# EAGLE design fdcanusb (EAGLE 9.6.0)
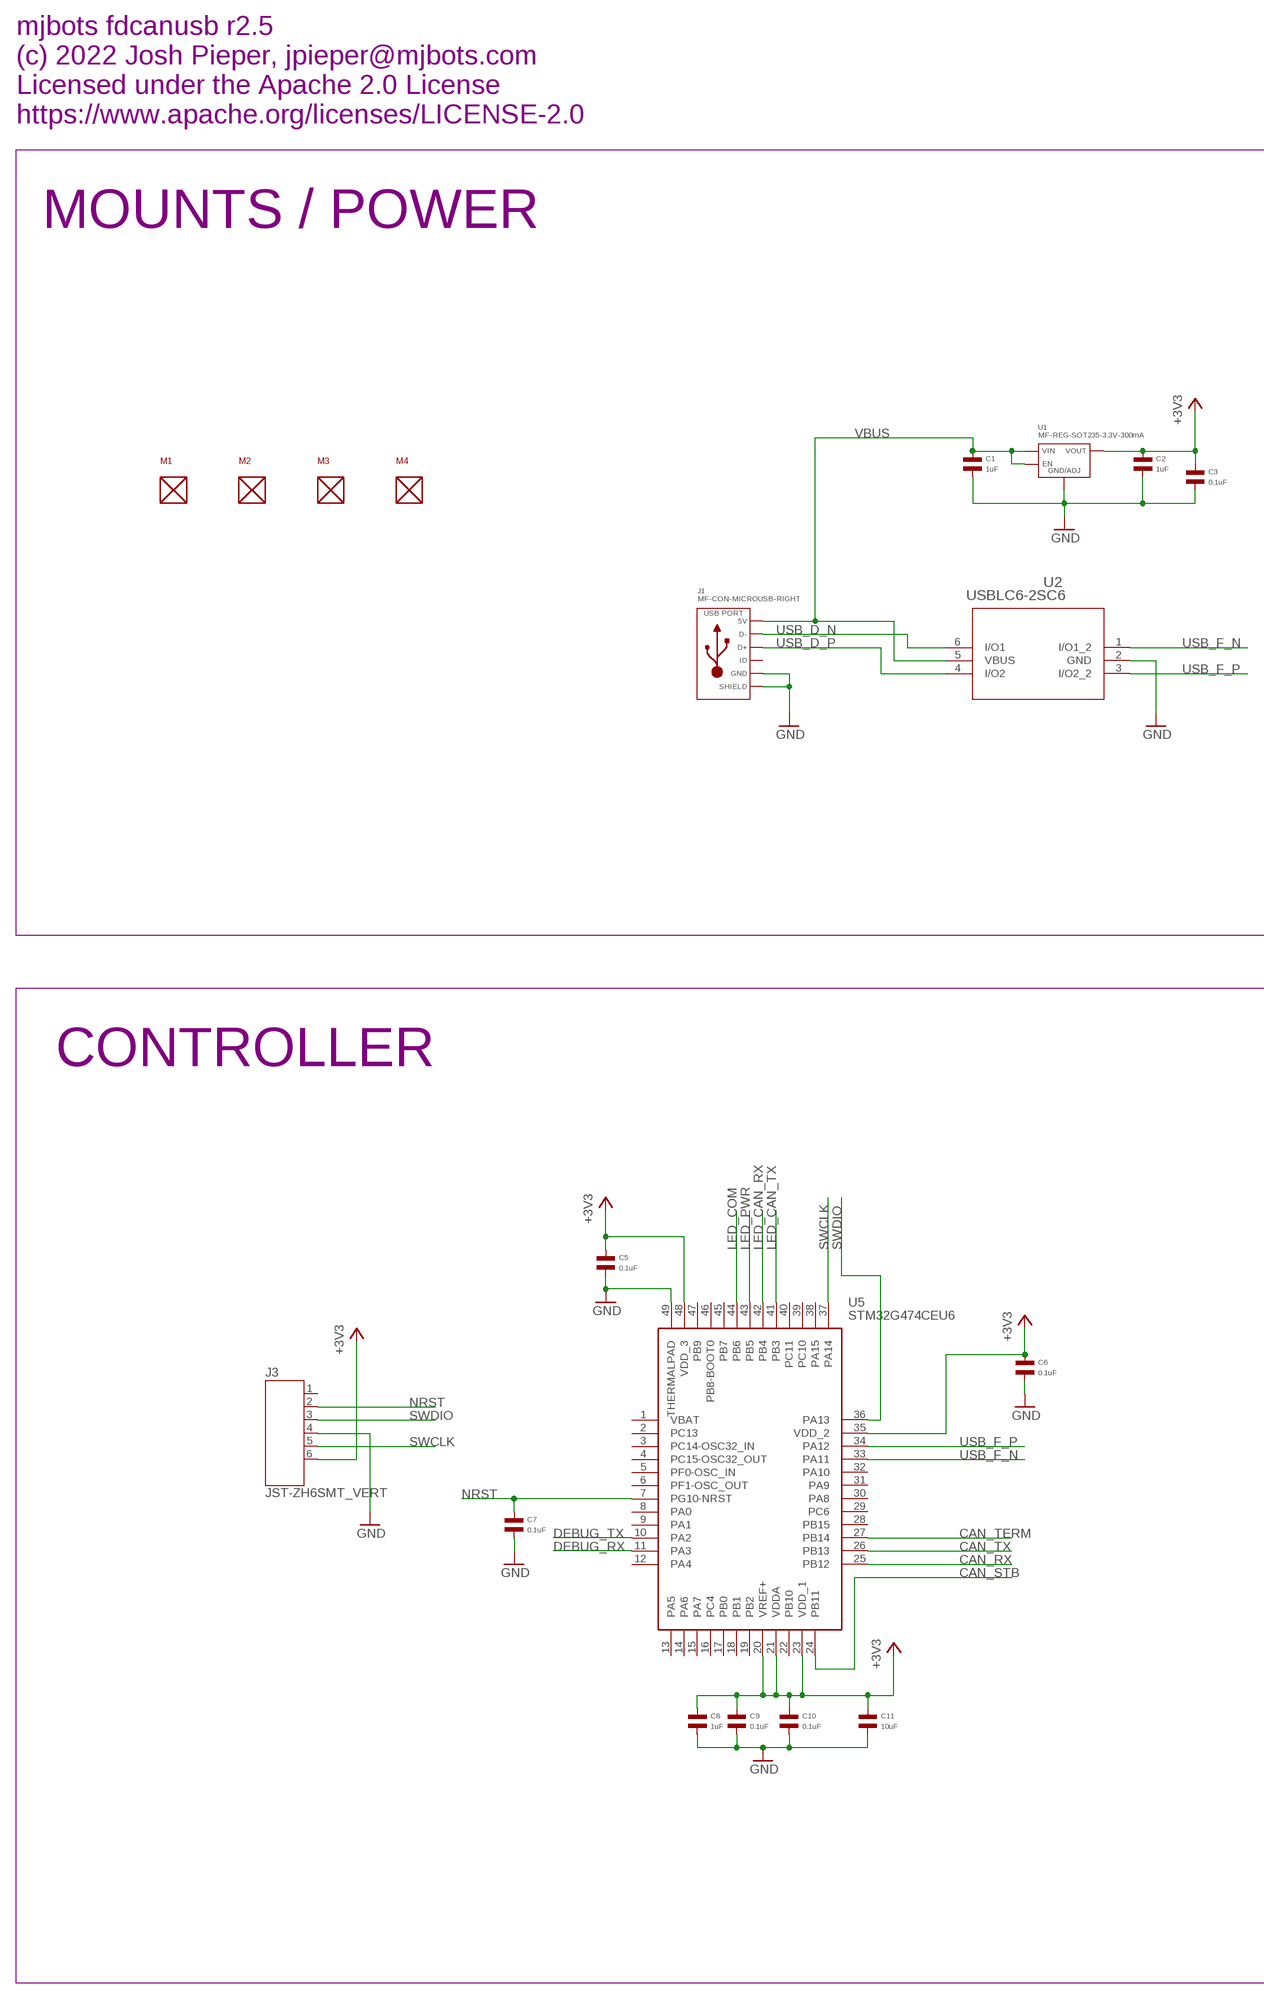
[diagram p0: schematic, sheet 1, part 1 of 2]
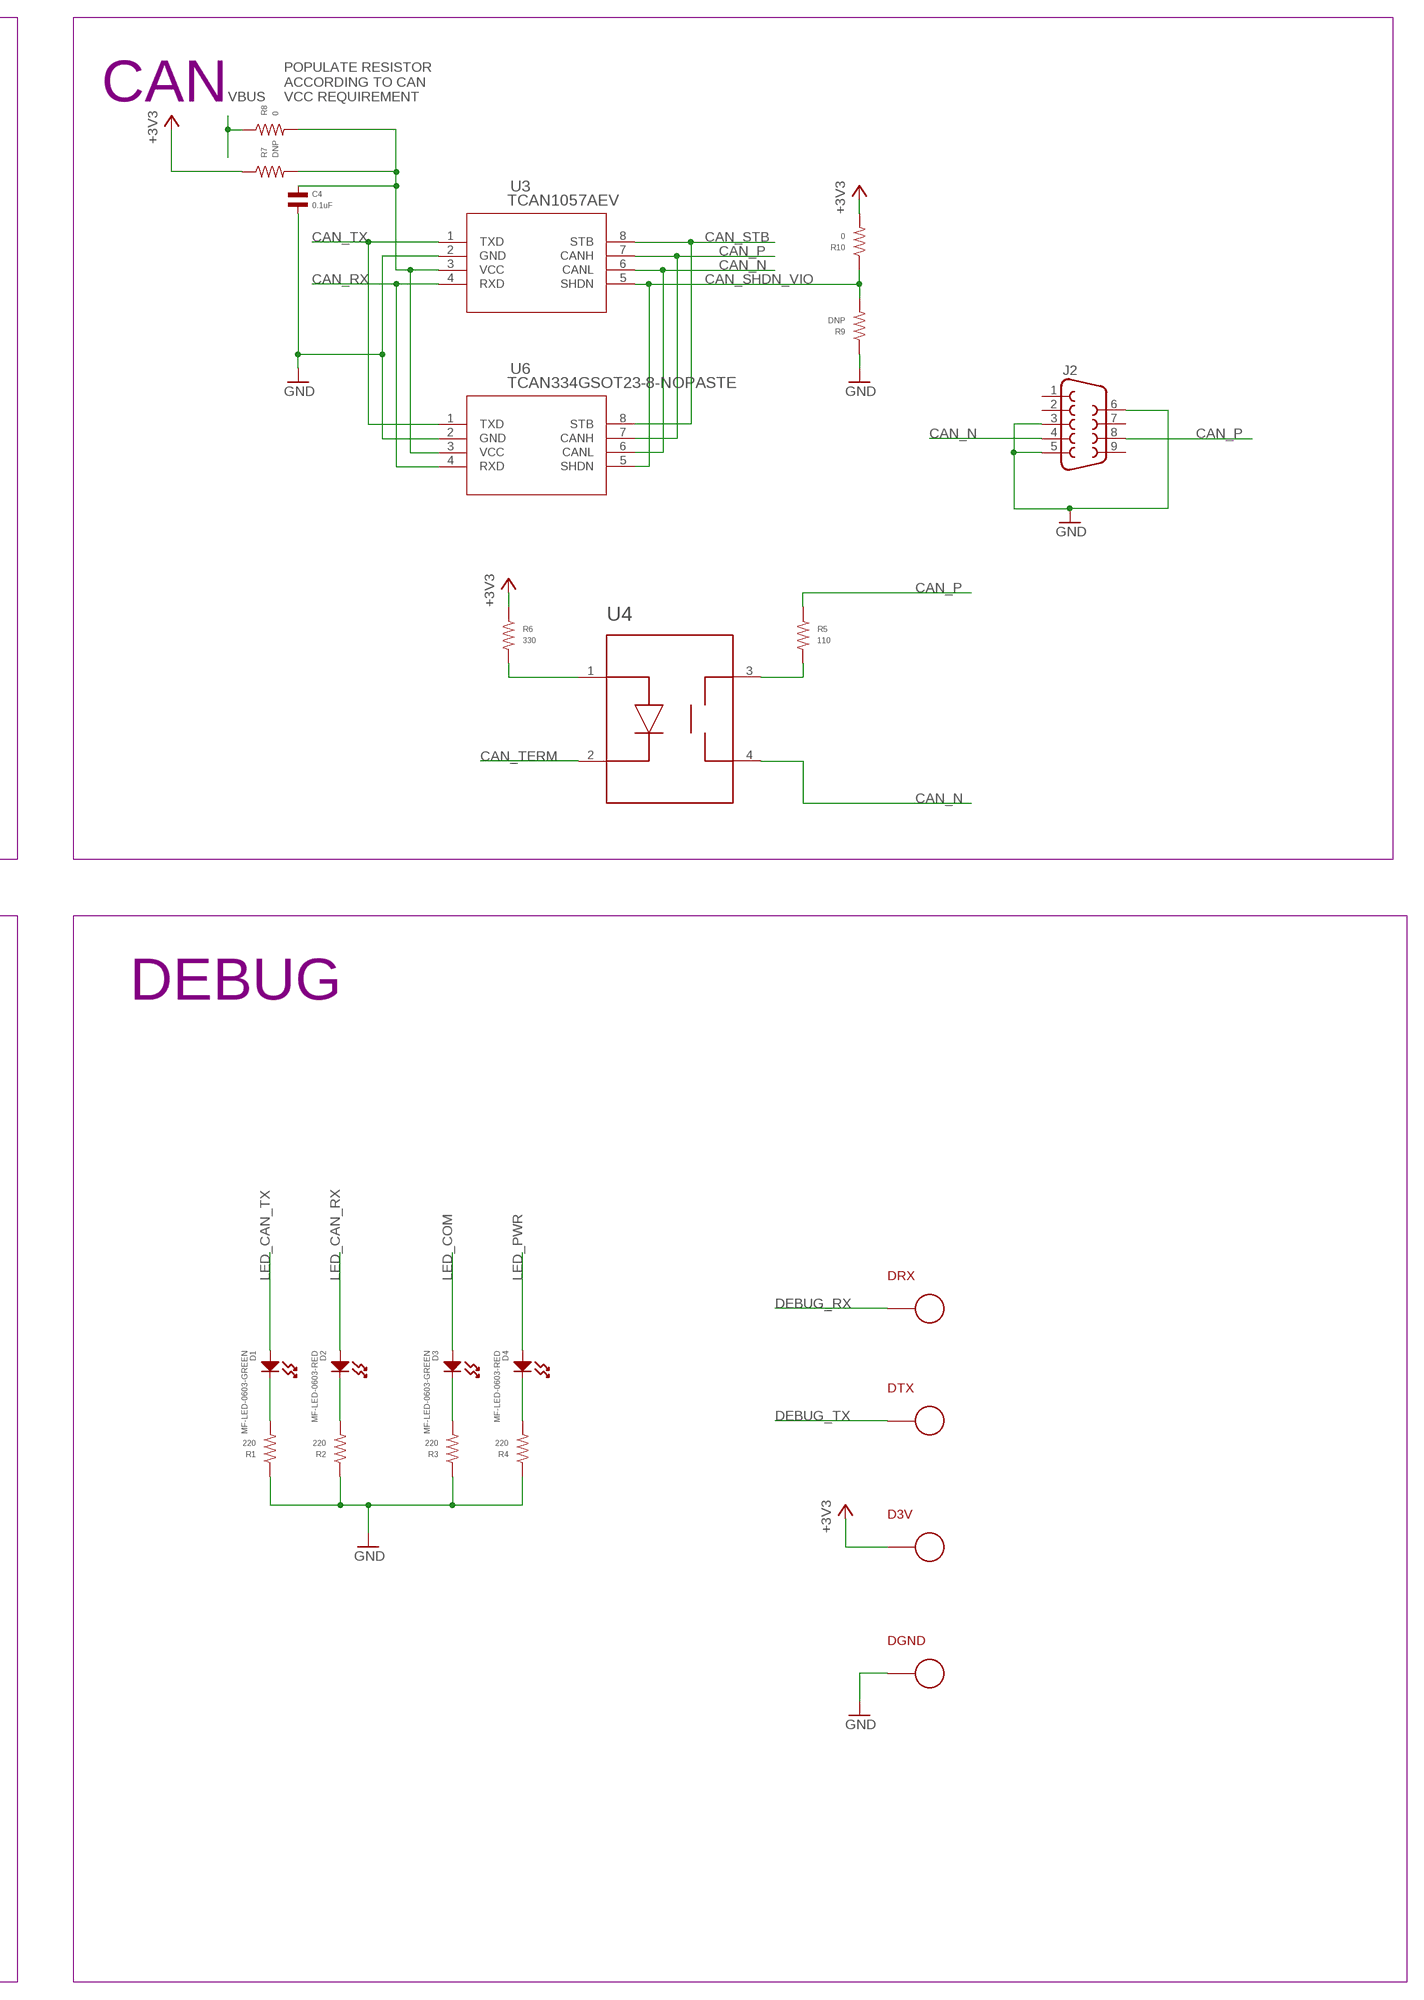
[diagram p1: schematic, sheet 1, part 2 of 2]

## Parts
C1  1uF  CAPACITOR_NP_0603  [C0603]
C2  1uF  CAPACITOR_NP_0603  [C0603]
C3  0.1uF  CAPACITOR_NP_0603  [C0603]
C4  0.1uF  CAPACITOR_NP_0603  [C0603]
C5  0.1uF  CAPACITOR_NP_0603  [C0603]
C6  0.1uF  CAPACITOR_NP_0603  [C0603]
C7  0.1uF  CAPACITOR_NP_0603  [C0603]
C8  1uF  CAPACITOR_NP_0603  [C0603]
C9  0.1uF  CAPACITOR_NP_0603  [C0603]
C10  0.1uF  CAPACITOR_NP_0603  [C0603]
C11  10uF  CAPACITOR_NP_1206  [C1206]
D1  MF-LED-0603-GREEN  LED_SINGLE-0603-GREEN  [LED0603]
D2  MF-LED-0603-RED  LED_SINGLE-0603-RED  [LED0603]
D3  MF-LED-0603-GREEN  LED_SINGLE-0603-GREEN  [LED0603]
D3V  PAD24AWG_PAD  [24AWG_PAD]
D4  MF-LED-0603-RED  LED_SINGLE-0603-RED  [LED0603]
DGND  PAD24AWG_PAD  [24AWG_PAD]
DRX  PAD24AWG_PAD  [24AWG_PAD]
DTX  PAD24AWG_PAD  [24AWG_PAD]
J1  MF-CON-MICROUSB-RIGHT  USB_MICRO_RIGHT  [MICROUSB-RIGHT]
J2  F09  [DB09_PLATED]
J3  JST-ZH6SMT_VERT  [JST_B6B-ZR-SM4-TF(LF)(SN)]
M1  MOUNT  [M2.5MOUNT]
M2  MOUNT  [M2.5MOUNT]
M3  MOUNT  [M2.5MOUNT]
M4  MOUNT  [M2.5MOUNT]
R1  220  RESISTOR_0603  [R0603]
R2  220  RESISTOR_0603  [R0603]
R3  220  RESISTOR_0603  [R0603]
R4  220  RESISTOR_0603  [R0603]
R5  110  RESISTOR_0603  [R0603]
R6  330  RESISTOR_0603  [R0603]
R7  DNP  RESISTOR_0603  [R0603]
R8  0  RESISTOR_0603  [R0603]
R9  DNP  RESISTOR_0603  [R0603]
R10  0  RESISTOR_0603  [R0603]
U1  MF-REG-SOT235-3.3V-300mA  TLV70233PDBVR  [SOT-23-5]
U2  USBLC6-2SC6  [SOT23-6L]
U3  TCAN1057AEV  TCAN334G  [SOIC8]
U4  TLP3317  [TLP3317]
U5  STM32G474CEU6  [QFN50P700X700X60-49N]
U6  TCAN334GSOT23-8-NOPASTE  [SOT23-8-NOPASTE]

## Nets
+3V3: C2.P$1 C3.P$1 C5.P$1 C6.P$1 C8.P$1 C9.P$1 C10.P$1 C11.P$1 D3V.P$1 J3.6 R6.P$1 R7.P$1 R10.P$2 U1.P$5(VOUT) U5.20(VREF+) U5.21(VDDA) U5.23(VDD_1) U5.35(VDD_2) U5.48(VDD_3)
CAN_N [can]: J2.4 U3.6(CANL) U4.4(SW2) U6.6(CANL)
CAN_P [can]: J2.8 R5.P$1 U3.7(CANH) U6.7(CANH)
CAN_RX: U3.4(RXD) U5.25(PB12) U6.4(RXD)
CAN_SHDN_VIO: R9.P$2 R10.P$1 U3.5(SHDN) U6.5(SHDN)
CAN_STB: U3.8(STB) U5.24(PB11) U6.8(STB)
CAN_TERM: U4.2(CATHODE) U5.27(PB14)
CAN_TX: U3.1(TXD) U5.26(PB13) U6.1(TXD)
DEBUG_RX: DRX.P$1 U5.11(PA3)
DEBUG_TX: DTX.P$1 U5.10(PA2)
GND: C1.P$2 C2.P$2 C3.P$2 C4.P$2 C5.P$2 C6.P$2 C7.P$2 C8.P$2 C9.P$2 C10.P$2 C11.P$2 DGND.P$1 J1.5(GND) J1.S1(SLD) J1.S2(SLD) J1.S3(SLD) J1.S4(SLD) J1.S5(SLD) J1.S6(SLD) J2.3 J2.5 J2.6 J3.4 R1.P$1 R2.P$1 R3.P$1 R4.P$1 R9.P$1 U1.P$2(GND/ADJ) U2.2(GND) U3.2(GND) U5.49(THERMALPAD) U6.2(GND)
LED_CAN_RX: D2.ANODE U5.42(PB4)
LED_CAN_TX: D1.ANODE U5.41(PB3)
LED_COM: D3.ANODE U5.44(PB6)
LED_PWR: D4.ANODE U5.43(PB5)
N$1: C4.P$1 R7.P$2 R8.P$2 U3.3(VCC) U6.3(VCC)
N$3: D1.CATHODE R1.P$2
N$4: D2.CATHODE R2.P$2
N$5: D3.CATHODE R3.P$2
N$6: D4.CATHODE R4.P$2
N$7: R5.P$2 U4.3(SW1)
N$8: R6.P$2 U4.1(ANODE)
NRST: C7.P$1 J3.2 U5.7(PG10-NRST)
SWCLK: J3.5 U5.37(PA14)
SWDIO: J3.3 U5.36(PA13)
USB_D_N [usb]: J1.2(D-) U2.6(I/O1)
USB_D_P [usb]: J1.3(D+) U2.4(I/O2)
USB_F_N [usb]: U2.1(I/O1_2) U5.33(PA11)
USB_F_P [usb]: U2.3(I/O2_2) U5.34(PA12)
VBUS: C1.P$1 J1.1(5V) R8.P$1 U1.P$1(VIN) U1.P$3(EN) U2.5(VBUS)
Unconnected: J1.4(ID) J2.1 J2.2 J2.7 J2.9 J3.1 U5.1(VBAT) U5.2(PC13) U5.3(PC14-OSC32_IN) U5.4(PC15-OSC32_OUT) U5.5(PF0-OSC_IN) U5.6(PF1-OSC_OUT) U5.8(PA0) U5.9(PA1) U5.12(PA4) U5.13(PA5) U5.14(PA6) U5.15(PA7) U5.16(PC4) U5.17(PB0) U5.18(PB1) U5.19(PB2) U5.22(PB10) U5.28(PB15) U5.29(PC6) U5.30(PA8) U5.31(PA9) U5.32(PA10) U5.38(PA15) U5.39(PC10) U5.40(PC11) U5.45(PB7) U5.46(PB8-BOOT0) U5.47(PB9)

## Notes on the sheet
- mjbots fdcanusb r2.5
  (c) 2022 Josh Pieper, jpieper@mjbots.com
  Licensed under the Apache 2.0 License
  https://www.apache.org/licenses/LICENSE-2.0
- MOUNTS / POWER | CAN
- POPULATE RESISTOR 
  ACCORDING TO CAN 
  VCC REQUIREMENT
- CONTROLLER | DEBUG

## Library data of the parts
C1 C2 C8 = mfpassives:CAPACITOR_NP: Library: MF_Passives Description: Device for Non-Polarized Capacitors. Manufacture part number (MPN) can be added via Attributes. Check https://factory.macrofab.com/parts for the house parts list.; HOUSEPART: YES; MPN: MF-CAP-0603-1uF; POPULATE: 1
C3-C7 C9 C10 = mfpassives:CAPACITOR_NP: Library: MF_Passives Description: Device for Non-Polarized Capacitors. Manufacture part number (MPN) can be added via Attributes. Check https://factory.macrofab.com/parts for the house parts list.; HOUSEPART: YES; MPN: MF-CAP-0603-0.1uF; POPULATE: 1
C11 = mfpassives:CAPACITOR_NP: Library: MF_Passives Description: Device for Non-Polarized Capacitors. Manufacture part number (MPN) can be added via Attributes. Check https://factory.macrofab.com/parts for the house parts list.; HOUSEPART: YES; MPN: MF-CAP-1206-10uF; POPULATE: 1
D1 D3 = mfleds:LED_SINGLE: Library: MF_LEDs Description: Device for Single LED Packages. Manufacture part number (MFG#) can be added via Attributes.; HOUSEPART: YES; MPN: MF-LED-0603-GREEN; POPULATE: 1; URL: https://factory.macrofab.com/part/MF-LED-0603-GREEN
D2 D4 = mfleds:LED_SINGLE: Library: MF_LEDs Description: Device for Single LED Packages. Manufacture part number (MFG#) can be added via Attributes.; HOUSEPART: YES; MPN: MF-LED-0603-RED; POPULATE: 1; URL: https://factory.macrofab.com/part/MF-LED-0603-RED
D3V DGND DRX DTX = fdcanusb:PAD; POPULATE: 0
J1 = mfconnectors:USB: Library: MF_Connectors Description: 5 Pin USB Connectors. SLD is the shield connection. Usually tied to ground through a small ferrite bead.; HOUSEPART: YES; MPN: MF-CON-MICROUSB-RIGHT; POPULATE: 1; URL: https://factory.macrofab.com/part/MF-CON-MICROUSB-RIGHT
J2 = fdcanusb:F09: SUB-D; POPULATE: 1
J3 = fdcanusb:JST-ZH6; MF: JST; MPN: B6B-ZR-SM4-TF(LF)(SN); POPULATE: 1
M1-M4 = fdcanusb:MOUNT; POPULATE: 0
R1-R4 = mfpassives:RESISTOR: Library: MF_Passives Description: Device for Resistors. Manufacture part number (MPN), Voltage, Tolerance, and Wattage Rating can be added via Attributes. Check https://factory.macrofab.com/parts for the house parts list.; HOUSEPART: YES; MPN: MF-RES-0603-220; POPULATE: 1
R5 = mfpassives:RESISTOR: Library: MF_Passives Description: Device for Resistors. Manufacture part number (MPN), Voltage, Tolerance, and Wattage Rating can be added via Attributes. Check https://factory.macrofab.com/parts for the house parts list.; MF: YAGEO; MPN: RC0603FR-07110RL; POPULATE: 1
R6 = mfpassives:RESISTOR: Library: MF_Passives Description: Device for Resistors. Manufacture part number (MPN), Voltage, Tolerance, and Wattage Rating can be added via Attributes. Check https://factory.macrofab.com/parts for the house parts list.; HOUSEPART: YES; MPN: MF-RES-0603-330; POPULATE: 1
R7 R9 = mfpassives:RESISTOR: Library: MF_Passives Description: Device for Resistors. Manufacture part number (MPN), Voltage, Tolerance, and Wattage Rating can be added via Attributes. Check https://factory.macrofab.com/parts for the house parts list.; HOUSEPART: YES; POPULATE: 0
R8 R10 = mfpassives:RESISTOR: Library: MF_Passives Description: Device for Resistors. Manufacture part number (MPN), Voltage, Tolerance, and Wattage Rating can be added via Attributes. Check https://factory.macrofab.com/parts for the house parts list.; HOUSEPART: YES; MPN: MF-RES-0603-0; POPULATE: 1
U1 = mficpower:TLV702: Manufacturer Part #: TLV702 Manufacturer: Texas Instruments Description: LDO Voltage Regulators; HOUSEPART: YES; MPN: MF-REG-SOT235-3.3V-300mA; POPULATE: 1; URL: https://factory.macrofab.com/part/MF-REG-SOT235-3.3V-300mA
U2 = fdcanusb:USBLC6-2SC6; MANUFACTURER_PART_NUMBER: USBLC62SC6; MF: ST; MPN: USBLC6-2SC6; POPULATE: 1; VENDOR: STMicroelectronics
U3 = fdcanusb:TCAN334G; MF: TI; MPN: TCAN1057AEVDRQ1; POPULATE: 1
U4 = fdcanusb:TLP3317; MF: TOSHIBA; MPN: TLP3317; POPULATE: 1
U5 = fdcanusb:STM32G474CEU6: STMICROELECTRONICS - STM32G474CEU6 - MCU, 32BIT, 170MHZ, UFQFPN-48 Source: Datasheet <https://componentsearchengine.com/Datasheets/1/STM32G474CEU6.pdf>; DESCRIPTION: STMICROELECTRONICS - STM32G474CEU6 - MCU, 32BIT, 170MHZ, UFQFPN-48; HEIGHT: 0.6mm; MANUFACTURER_NAME: STMicroelectronics; MANUFACTURER_PART_NUMBER: STM32G474CEU6; MF: ST; MOUSER_PART_NUMBER: 511-STM32G474CEU6; MOUSER_PRICE-STOCK: https://www.mouser.com/Search/Refine.aspx?Keyword=511-STM32G474CEU6; MPN: STM32G474CEU6; POPULATE: 1
U6 = controller:TCAN334G; MF: TI; MPN: TCAN334GDCNT; POPULATE: 0

## Net classes
1 usb: width 0.305 mm, clearance 0.152 mm
2 can: width 0.216 mm, clearance 0.152 mm

## Board
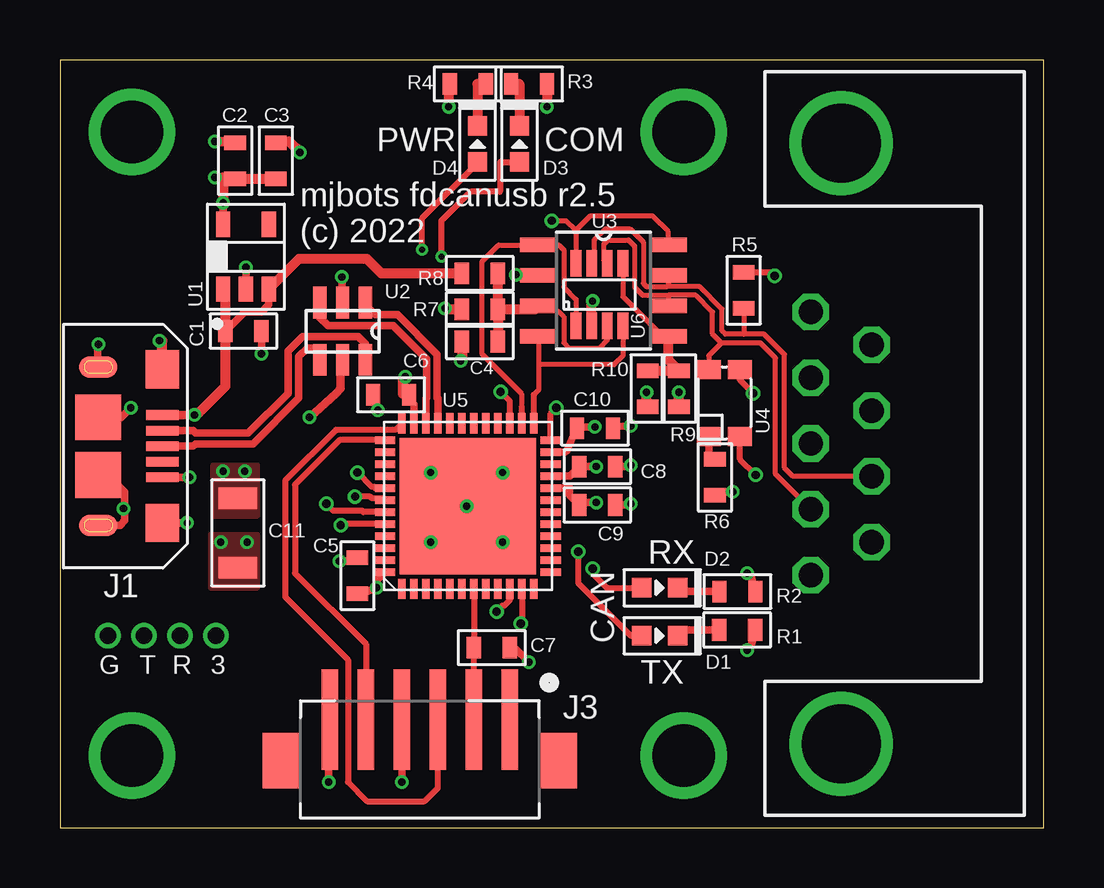
[diagram p2: board, top side]
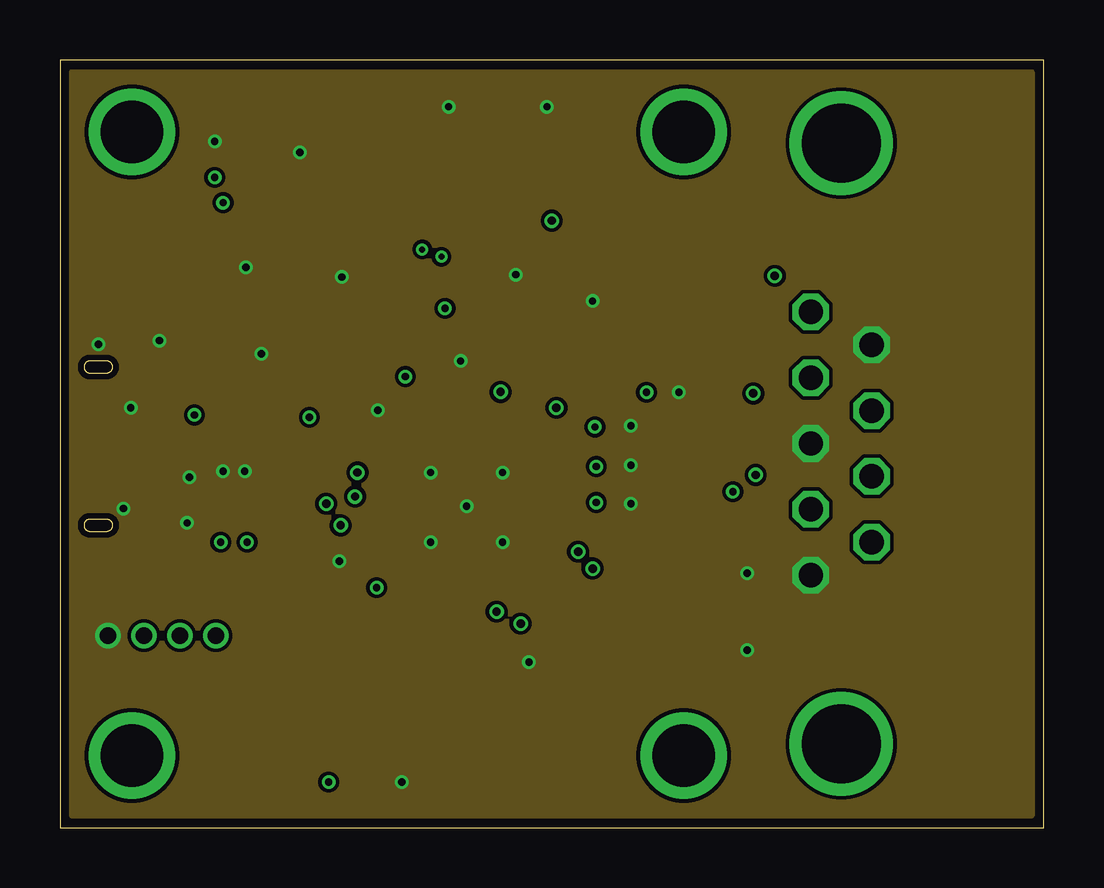
[diagram p3: board, inner layer Route2]
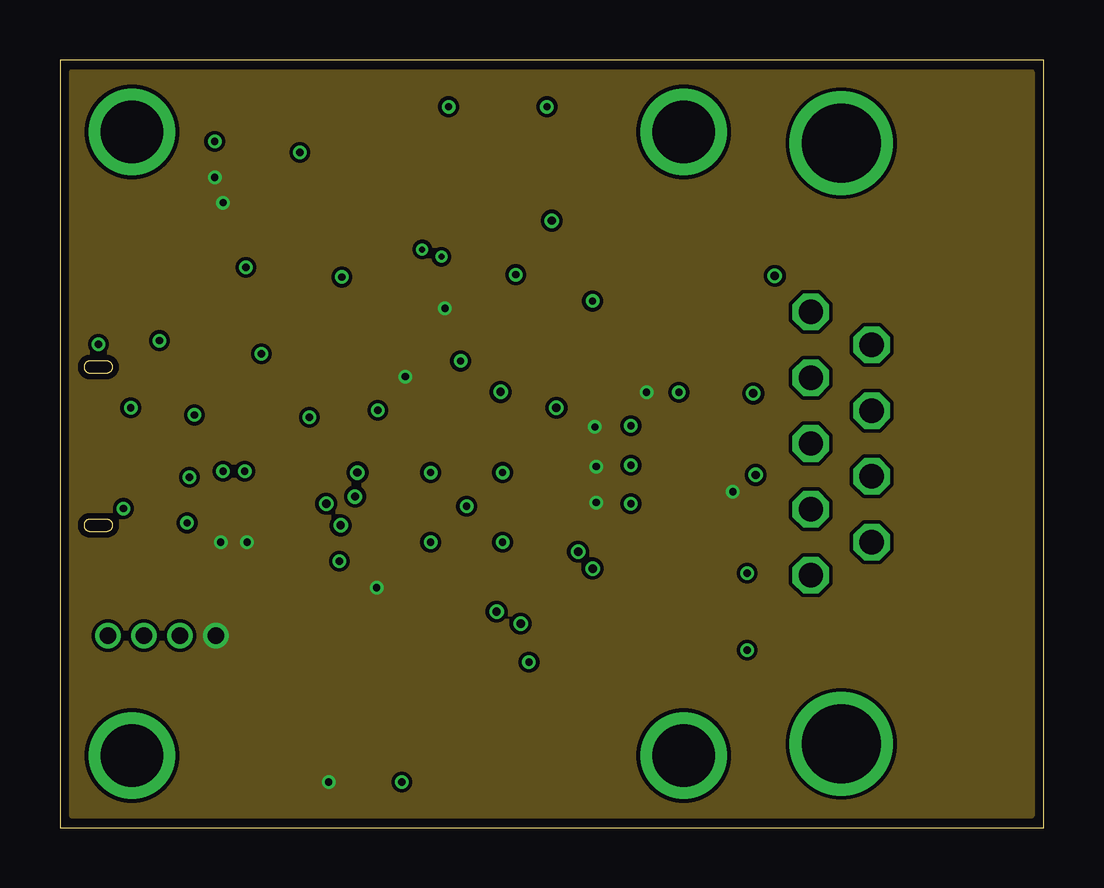
[diagram p4: board, inner layer Route15]
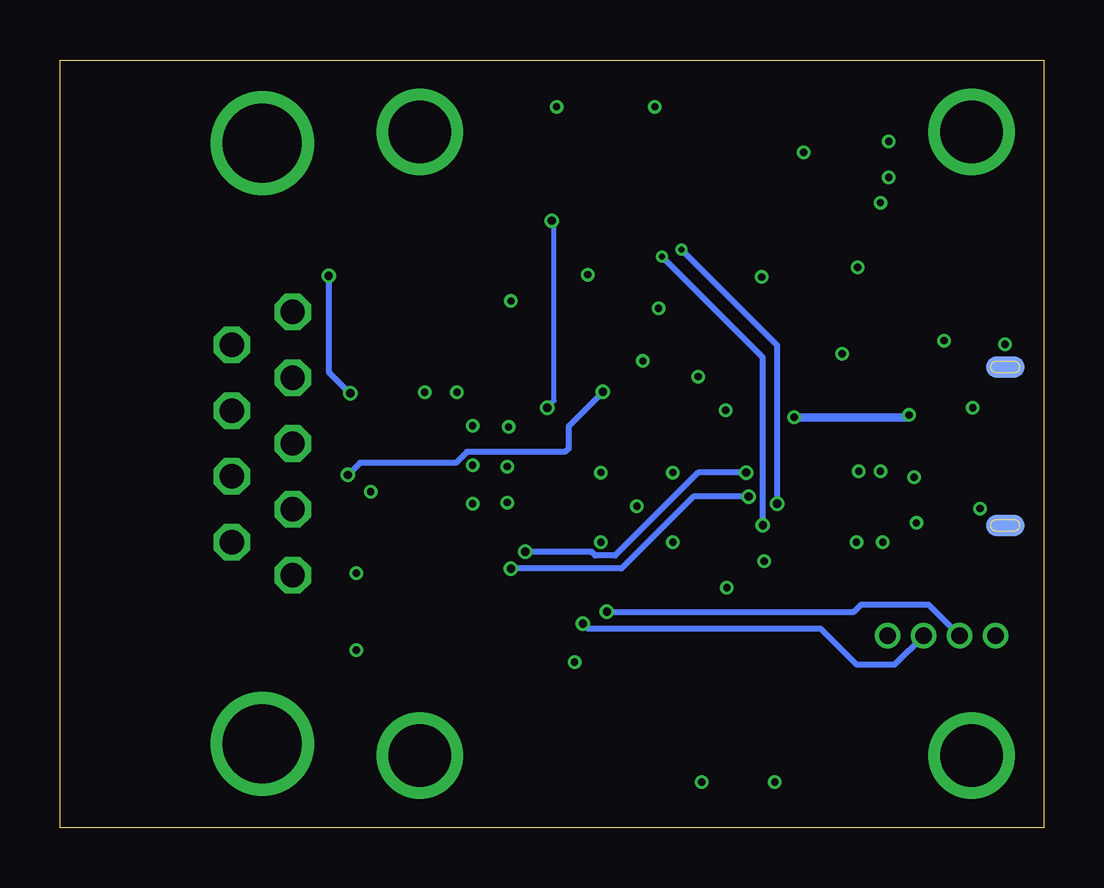
[diagram p5: board, bottom side, seen from below]

Size 41 x 32 mm. Coordinates in mm from the lower left corner, seen from the top.
Outline: 0,0 41,0 41,32 0,32 0,0
Copper layers (1*2*15*16): Top 0.035mm / dielectric 0.23mm / Route2 0.035mm / dielectric 0.93mm / Route15 0.035mm / dielectric 0.23mm / Bottom 0.035mm
Design rules "MF_Standard_4_Layer *": minimum track width 6mil, minimum drill 10mil, track to track 6mil, track to pad 6mil, pad to pad 6mil, via to via 6mil, smd to smd 0mil, copper to edge 10mil, drill to drill 10mil, minimum pad ring 5mil, minimum via ring 5mil, stop-mask expansion 2mil, vias tented up to drill 25mil, thermal gap 10mil

### Footprints (pad centres in the part's own frame; a part is rotated, then mirrored left to right if it is on the bottom)
C0603 = smd 0.6 x 0.9: P$1 -0.75,0; P$2 0.75,0
C1206 = smd 0.9 x 1.6: P$1 -1.45,0; P$2 1.45,0
LED0603 = smd 0.8 x 0.8: ANODE 0.75,0; CATHODE -0.75,0
24AWG_PAD = drill 0.7: P$1 0,0
MICROUSB-RIGHT = smd 0.4 x 1.35: 1 -1.3,1.27; 2 -0.65,1.27; 3 0,1.27; 4 0.65,1.27; 5 1.3,1.27 | smd 0.9 x 1.6: S1 -3.3,-1.4; S2 3.3,-1.4 | smd 1.6 x 1.4: S3 -3.2,1.27; S4 3.2,1.27 | smd 1.9 x 1.9: S5 -1.2,-1.405; S6 1.2,-1.405 | smd 0.9 x 1.6 bottom: S7 -3.3,-1.4; S8 3.3,-1.4
DB09_PLATED = drill 1.016 octagon: 1 -5.486,-1.27; 2 -2.743,-1.27; 3 0,-1.27; 4 2.743,-1.27; 5 5.486,-1.27; 6 -4.115,1.27; 7 -1.372,1.27; 8 1.372,1.27; 9 4.115,1.27 | drill 3.302: S1 -12.522,0; S2 12.522,0
JST_B6B-ZR-SM4-TF(LF)(SN) = smd 0.7 x 4.2: 1 -3.75,-2; 2 -2.25,-2; 3 -0.75,-2; 4 0.75,-2; 5 2.25,-2; 6 3.75,-2 | smd 1.5 x 2.3: P1 -5.8,-0.29; P2 5.8,-0.29
M2.5MOUNT = drill 2.6: P$1 0,0
R0603 = smd 0.6 x 0.9: P$1 -0.75,0; P$2 0.75,0
SOT-23-5 = smd 1.05 x 0.6: P$1 -1.35,0.95; P$2 -1.35,0; P$3 -1.35,-0.95; P$4 1.35,-0.95; P$5 1.35,0.95
SOT23-6L = smd 1.321 x 0.559: 1 -1.194,0.95; 2 -1.194,0; 3 -1.194,-0.95; 4 1.194,-0.95; 5 1.194,0; 6 1.194,0.95
SOIC8 = smd 1.549 x 0.61: 1 -2.7,1.905; 2 -2.7,0.635; 3 -2.7,-0.635; 4 -2.7,-1.905; 5 2.7,-1.905; 6 2.7,-0.635; 7 2.7,0.635; 8 2.7,1.905
TLP3317 = smd 1 x 0.8: 1 -0.65,-1.4; 2 0.65,-1.4; 3 0.65,1.4; 4 -0.65,1.4
QFN50P700X700X60-49N = smd 0.85 x 0.3: 1 -3.45,2.75; 2 -3.45,2.25; 3 -3.45,1.75; 4 -3.45,1.25; 5 -3.45,0.75; 6 -3.45,0.25; 7 -3.45,-0.25; 8 -3.45,-0.75; 9 -3.45,-1.25; 10 -3.45,-1.75; 11 -3.45,-2.25; 12 -3.45,-2.75; 25 3.45,-2.75; 26 3.45,-2.25; 27 3.45,-1.75; 28 3.45,-1.25; 29 3.45,-0.75; 30 3.45,-0.25; 31 3.45,0.25; 32 3.45,0.75; 33 3.45,1.25; 34 3.45,1.75; 35 3.45,2.25; 36 3.45,2.75 | smd 0.3 x 0.85: 13 -2.75,-3.45; 14 -2.25,-3.45; 15 -1.75,-3.45; 16 -1.25,-3.45; 17 -0.75,-3.45; 18 -0.25,-3.45; 19 0.25,-3.45; 20 0.75,-3.45; 21 1.25,-3.45; 22 1.75,-3.45; 23 2.25,-3.45; 24 2.75,-3.45; 37 2.75,3.45; 38 2.25,3.45; 39 1.75,3.45; 40 1.25,3.45; 41 0.75,3.45; 42 0.25,3.45; 43 -0.25,3.45; 44 -0.75,3.45; 45 -1.25,3.45; 46 -1.75,3.45; 47 -2.25,3.45; 48 -2.75,3.45 | smd 5.7 x 5.7: 49 0,0
SOT23-8-NOPASTE = smd 0.45 x 1.1: 1 -0.975,-1.3; 2 -0.325,-1.3; 3 0.325,-1.3; 4 0.975,-1.3; 5 0.975,1.3; 6 0.325,1.3; 7 -0.325,1.3; 8 -0.975,1.3

### Placement (x,y rotation side)
C1  7.65,20.7 0 top
C2  7.3,27.8 90 top
C3  9,27.8 90 top
C4  17.5,20.26 180 top
C5  12.4,10.5 90 top
C6  13.8,18.04 180 top
C7  18,7.5 0 top
C8  22.4,15.05 0 top
C9  22.4,13.45 0 top
C10  22.3,16.65 0 top
C11  7.42,12.28 90 top
D1  25,8 180 top
D2  25,10 180 top
D3  19.15,28.5 270 top
D3V  6.5,8 0 top
D4  17.4,28.5 270 top
DGND  2,8 0 top
DRX  5,8 0 top
DTX  3.5,8 0 top
J1  3,15.9 270 top
J2  32.57,16.01 270 top
J3  15,2.5 180 top
M1  26,3 0 top
M2  26,29 0 top
M3  3,3 0 top
M4  3,29 0 top
R1  28.23,8.24 180 top
R2  28.24,9.84 180 top
R3  19.55,31 180 top
R4  17,31 0 top
R5  28.5,22.4 90 top
R6  27.3,14.6 90 top
R7  17.5,21.6 0 top
R8  17.5,23.1 0 top
R9  25.8,18.3 90 top
R10  24.5,18.3 270 top
U1  7.75,23.8 90 top
U2  11.78,20.69 270 top
U3  22.66,22.38 0 top
U4  27.7,17.7 0 top
U5  17,13.4 90 top
U6  22.49,22.22 0 top

### Tracks (layer width: path | path; a pad name or v marks a point on that pad's centre or on a via)
+3V3  (via drill 0.3)
  Top 0.305: U1.P$5 6.8,26 v6.8,26.05 | C2.P$1 v6.45,27.1 | C5.P$1 13.15,9.95 v13.2,10 13.2,10.3 U5.48 | 14.3,18.09 C6.P$1 14.75,17.64 U5.35 | J3.6 11.2,4.45 v11.2,1.9 | v22.3,16.7 21.6,16.7 C10.P$1 21.5,16.6 21.12,15.72 21.05,15.65 U5.23 | v22.35,15.05 C8.P$1 21.25,14.65 U5.21 | R6.P$1 28,14.05 v28.05,14 | U5.20 21.23,14.15 21.23,13.87 C9.P$1 21.75,13.55 v22.35,13.55
  Top 0.406: 6.8,26 6.8,27.1 C2.P$1 C3.P$1 | 14.3,18.09 14.3,18.7 v14.4,18.8 | R10.P$2 24.45,17.6 v24.45,18.15 | R7.P$1 16.1,21.6 v16.05,21.65
  other vias: 6.7,11.9 7.8,11.9
  pour Route15 (no thermals): 0.5,31.5 40.5,31.5 40.5,0.5 0.5,0.5
  pour Top (no thermals): 8.2,12.2 8.2,10 6.3,10 6.3,12.2
CAN_N
  Top 0.216: J2.4 29.83,14.73 29.83,19.57 29.2,20.2 27.58,20.2 | 27.58,20.2 27.05,19.67 U4.4 | 27.58,20.2 27.2,20.58 27.2,21.5 26.51,22.19 25.36,22.19 U3.6 25.36,22.15 25.32,22.19 24.29,22.19 23.95,22.53 23.95,24.25 23.7,24.5 22.85,24.5 22.66,24.31 22.66,23.67 U6.6
CAN_P
  Top 0.216: 28.5,20.57 29.35,20.57 30.2,19.72 30.2,15 30.56,14.64 J2.8 | 28.5,20.57 27.73,20.57 27.6,20.7 27.6,21.62 26.65,22.57 25.31,22.57 25.36,22.62 U3.7 25.36,22.6 25.32,22.56 24.44,22.56 24.32,22.68 24.32,24.4 23.75,24.97 22.73,24.97 22.27,24.5 22.27,23.62 U6.7 | R5.P$1 28.5,20.57
CAN_RX
  Top 0.216: 19.75,18.05 19.96,18.26 19.96,19.3 | 19.96,19.3 U3.4 | U6.4 23.46,19.66 23.1,19.3 19.96,19.3
  Top 0.254: U5.25 19.75,18.05
CAN_SHDN_VIO
  Top 0.216: U6.5 23.46,22.14 25.12,20.48 U3.5
  Top 0.406: R10.P$1 R9.P$2 25.36,19.49 U3.5
CAN_STB  (via drill 0.35)
  Top 0.216: U3.8 25.36,24.84 24.7,25.5 22.1,25.5 21.5,24.9 | 21.5,24.9 21.5,23.54 U6.8 | v20.5,25.3 21.1,25.3 21.5,24.9
  Top 0.254: U5.24 20.45,17.25 v20.7,17.5
  Bottom 0.216: v20.7,17.5 20.4,17.8 20.4,25.2 v20.5,25.3
CAN_TERM  (via drill 0.35)
  Top 0.254: U5.27 18.75,17.77 v18.37,18.16 | v29,14.7 28.35,15.35 U4.2
  Bottom 0.254: v18.37,18.16 19.8,16.73 19.8,15.8 19.94,15.66 24.03,15.66 24.49,15.2 28.5,15.2 v29,14.7
CAN_TX
  Top 0.216: 19.25,17.55 19.25,17.58 19.26,17.59 19.26,18.07 17.6,19.73 17.6,23.6 18.29,24.29 U3.1 20.8,24.29 21,24.08 21,22.54 21.52,22.02 U6.1
  Top 0.254: U5.26 19.25,17.55
DEBUG_RX  (via drill 0.35)
  Top 0.254: U5.11 19.25,8.55 v19.2,8.5
  Bottom 0.254: v19.2,8.5 19,8.3 9.3,8.3 7.8,6.8 6.2,6.8 DRX.P$1
DEBUG_TX  (via drill 0.35)
  Top 0.254: v18.2,9 18.45,9.25 18.52,9.25 18.75,9.48 U5.10
  Bottom 0.254: DTX.P$1 4.8,9.3 7.6,9.3 7.9,9 v18.2,9
GND  (via drill 0.3)
  Top 0.305: J1.5 v5.4,14.6 | J1.S1 1.57,19.98 v1.6,20.15 | C1.P$2 v8.4,19.75 | U1.P$2 v7.75,23.35 | C5.P$2 11.7,11.05 v11.65,11.1 | C6.P$2 v13.25,17.4 | J3.4 v14.25,1.9 | C7.P$2 18.95,7.5 v19.55,6.9 | v28.65,10.6 28.82,10.43 R2.P$1 | R1.P$1 28.8,7.55 v28.65,7.4 | C8.P$2 23.75,15.05 v23.8,15.1 | v23.8,13.5 23.75,13.45 C9.P$2 | C10.P$2 23.03,16.72 v23.8,16.75 | U2.2 11.75,21.91 v11.75,22.95 | v2.95,17.5 2.55,17.1 J1.S5 | J1.S2 2.5,12.6 2.7,12.8 2.7,13.25 v2.65,13.3 2.69,13.35 2.69,14 2,14.7 J1.S6 | v5.3,12.7 J1.S4 | U5.49 v16.95,13.4
  Top 0.406: C2.P$2 v6.45,28.6 | C3.P$2 9.55,28.6 v10,28.15 | R4.P$1 16.2,31 v16.2,30.05 | R3.P$1 v20.3,30.05 | J1.S3 4.27,20.3 v4.15,20.3 | R9.P$1 v25.8,18.15 | U6.2 22.16,21.91 v22.2,21.95 | U3.2 19.04,23.02 v19,23.05 | C4.P$2 16.75,19.5 v16.7,19.45
  other vias: 7.7,14.85 6.8,14.85 15.45,14.8 18.45,14.8 18.45,11.9 15.45,11.9
  pour Route2 (no thermals): 0.5,31.5 40.5,31.5 40.5,0.5 0.5,0.5
  pour Top (no thermals): 8.2,15.1 8.2,13 6.4,13 6.4,15.1
LED_CAN_RX  (via drill 0.35)
  Top 0.254: U5.42 13.48,13.72 13.01,13.72 12.93,13.8 v12.3,13.8 | v22.2,10.8 22.2,10.6 22.8,10 D2.ANODE
  Bottom 0.254: v12.3,13.8 14.6,13.8 17.6,10.8 v22.2,10.8
LED_CAN_TX  (via drill 0.35)
  Top 0.254: U5.41 13.15,14.15 13.1,14.21 12.99,14.21 v12.4,14.8 | v21.6,11.5 21.6,10.2 23.8,8 D1.ANODE
  Bottom 0.254: v12.4,14.8 14.4,14.8 17.86,11.34 18.68,11.34 18.84,11.5 v21.6,11.5
LED_COM  (via drill 0.25, 0.35)
  Top 0.254: D3.ANODE 18.35,27.75 18.34,26.51 17.11,26.51 15.9,25.3 v15.9,23.8 | U5.44 11.75,12.65 v11.7,12.6
  Bottom 0.254: v15.9,23.8 11.7,19.6 v11.7,12.6
LED_PWR  (via drill 0.25, 0.35)
  Top 0.254: v15.1,24.1 15.1,25.4 17.4,27.7 D4.ANODE | U5.43 12.65,13.15 12.6,13.2 11.4,13.2 v11.1,13.5
  Bottom 0.254: v15.1,24.1 11.1,20.1 v11.1,13.5
N$1
  Top 0.216: U3.3 20.55,21.75 21,21.3 21,20.2 21.2,20 22.5,20 22.82,20.32 U6.3
  Top 0.406: U3.3 19.82,21.6 R7.P$2 | R7.P$2 R8.P$2 | R7.P$2 C4.P$1
N$3
  Top 0.305: R1.P$2 25.99,8.24 D1.CATHODE
N$4
  Top 0.305: R2.P$2 25.91,9.84 D2.CATHODE
N$5
  Top 0.406: R3.P$2 19.15,31 D3.CATHODE
N$6
  Top 0.406: R4.P$2 17.4,31 D4.CATHODE
N$7  (via drill 0.35)
  Top 0.254: R5.P$2 29.74,23.15 29.77,23.03 v29.8,23 | v28.9,18.1 28.35,18.65 U4.3
  Bottom 0.254: v29.8,23 29.8,19 v28.9,18.1
N$8
  Top 0.305: U4.1 27.05,15.4 R6.P$2
NRST
  Top 0.254: U5.7 17.25,7.7 C7.P$1 17.25,7.3 J3.2
SWCLK
  Top 0.254: U5.37 11.65,16.15 9.8,14.3 9.8,10.6 12.75,7.65 J3.5
SWDIO
  Top 0.254: U5.36 13.98,16.58 11.51,16.58 9.39,14.47 9.39,9.61 12,7 12,1.9 12.8,1.1 15.2,1.1 15.75,1.65 J3.3
USB_D_N
  Top 0.305: J1.2 5.55,16.55 5.65,16.45 7.85,16.45 9.5,18.1 9.5,19.86 10.11,20.46 12.42,20.46 12.73,20.15 U2.6
USB_D_P
  Top 0.305: U2.4 10.83,19.95 10.79,19.99 10.32,19.99 9.96,19.63 9.96,17.91 8.04,16 5.65,16 5.55,15.9 J1.3
USB_F_N
  Top 0.305: U2.1 12.74,21.77 13.14,21.38 14.07,21.38 15.73,19.72 15.73,17.91 15.75,17.89 U5.33
USB_F_P
  Top 0.305: U5.34 15.25,17.89 15.27,17.91 15.27,19.53 13.88,20.92 11.18,20.92 10.83,21.27 U2.3
VBUS  (via drill 0.3)
  Top 0.305: U1.P$3 8.7,21.8 8.4,21.5 7.7,21.5 C1.P$1
  Top 0.356: J1.1 v5.6,17.2 | U2.5 11.7,19.42 11.7,18.3 11.5,18.1 v10.4,17.1
  Top 0.406: v5.6,17.2 5.7,17.2 6.9,18.4 C1.P$1 6.9,22.35 U1.P$1 | U1.P$3 9.95,23.7 12.8,23.7 13.4,23.1 R8.P$1
  Bottom 0.356: v10.4,17.1 5.7,17.1 v5.6,17.2

### Text on the board
tPlace: PWR | COM | mjbots fdcanusb r2.5 / (c) 2022 | RX | CAN | G | T | R | 3 | TX